# Altium project SmartWatch.PrjPcb (part 2 of 2)

## Sheet BioZ_Sensor.SchDoc
size 420 x 297 mm
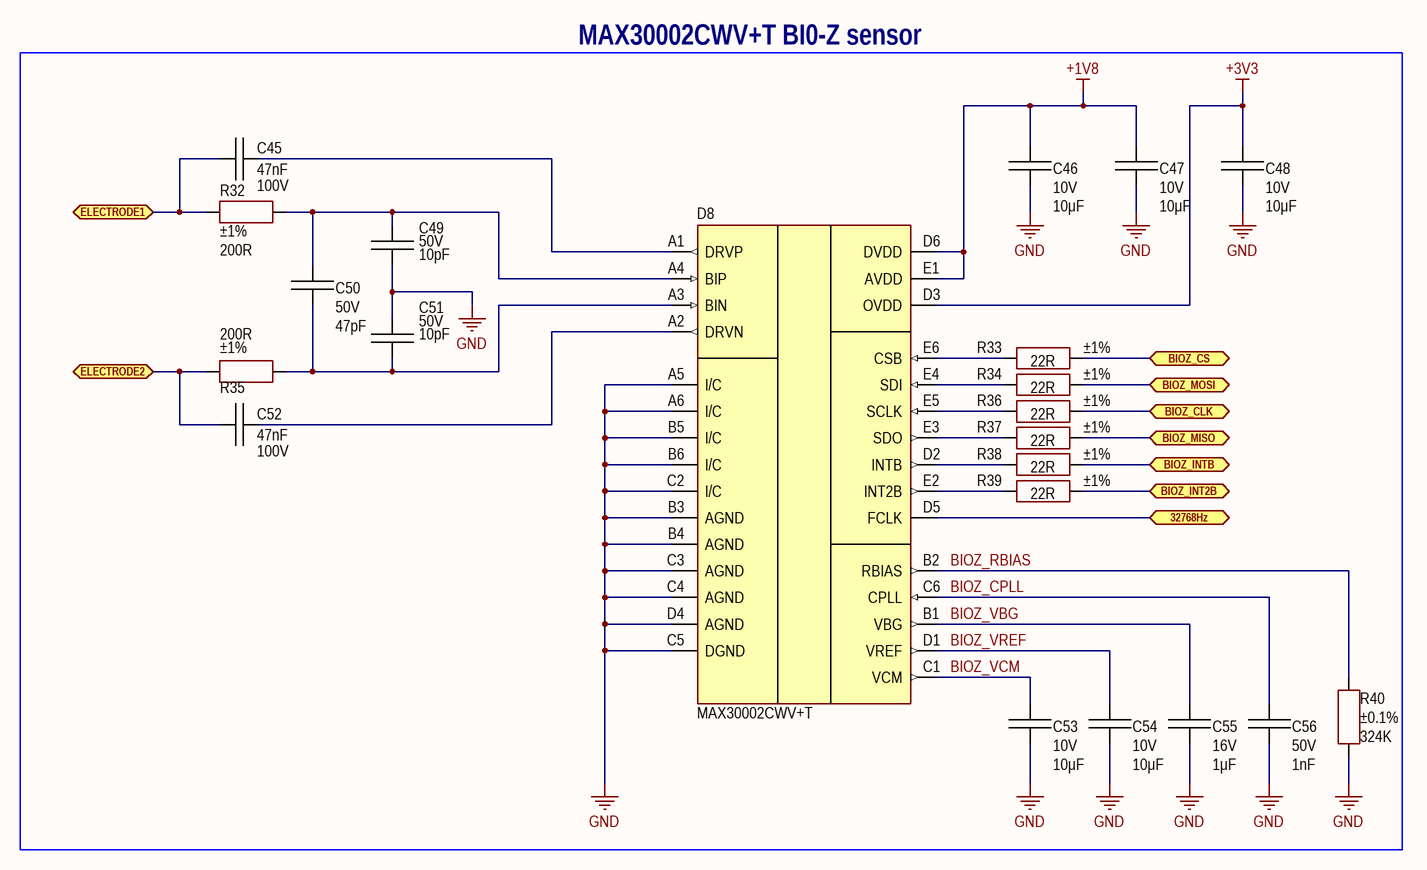
[diagram p9: BioZ_Sensor.SchDoc]

### Parts
C45  value 47nF  Voltage: 100V  [CAP: 0805]
C46  value 10μF  Voltage: 10V  [CAP: 0805]
C47  value 10μF  Voltage: 10V  [CAP: 0805]
C48  value 10μF  Voltage: 10V  [CAP: 0805]
C49  value 10pF  Voltage: 50V  [CAP: 0805]
C50  value 47pF  Voltage: 50V  [CAP: 0805]
C51  value 10pF  Voltage: 50V  [CAP: 0805]
C52  value 47nF  Voltage: 100V  [CAP: 0805]
C53  value 10μF  Voltage: 10V  [CAP: 0805]
C54  value 10μF  Voltage: 10V  [CAP: 0805]
C55  value 1μF  Voltage: 16V  [CAP: 0805]
C56  value 1nF  Voltage: 50V  [CAP: 0805]
D8  (no value)  [IC: 30-WLP]
R32  value 200R  Tolerance: ±1%  [RES: 0805]
R33  value 22R  Tolerance: ±1%  [RES: 0805]
R34  value 22R  Tolerance: ±1%  [RES: 0805]
R35  value 200R  Tolerance: ±1%  [RES: 0805]
R36  value 22R  Tolerance: ±1%  [RES: 0805]
R37  value 22R  Tolerance: ±1%  [RES: 0805]
R38  value 22R  Tolerance: ±1%  [RES: 0805]
R39  value 22R  Tolerance: ±1%  [RES: 0805]
R40  value 324K  Tolerance: ±0.1%  [RES: 0805]

### Blocks framed on the sheet
MAX30002CWV+T BI0-Z sensor: C45-C56 D8 R32-R40

### Ports
32768Hz (bidir), BIOZ_CLK (bidir), BIOZ_CS (bidir), BIOZ_INT2B (bidir), BIOZ_INTB (bidir), BIOZ_MISO (bidir), BIOZ_MOSI (bidir), ELECTRODE1 (bidir), ELECTRODE2 (bidir)

### Nets
+1V8: C46.2 C47.2 D8.D6(DVDD) D8.E1(AVDD)
+3V3: C48.2 D8.D3(OVDD)
GND: C46.1 C47.1 C48.1 C49.1 C51.2 C53.1 C54.1 C55.1 C56.1 D8.A5(I/C) D8.A6(I/C) D8.B3(AGND) D8.B4(AGND) D8.B5(I/C) D8.B6(I/C) D8.C2(I/C) D8.C3(AGND) D8.C4(AGND) D8.C5(DGND) D8.D4(AGND) R40.1
32768Hz: D8.D5(FCLK) ; port 32768Hz
BIOZ_CPLL: C56.2 D8.C6(CPLL)
BIOZ_RBIAS: D8.B2(RBIAS) R40.2
BIOZ_VBG: C55.2 D8.B1(VBG)
BIOZ_VCM: C53.2 D8.C1(VCM)
BIOZ_VREF: C54.2 D8.D1(VREF)
NetC45_1: C45.1 D8.A1(DRVP)
NetC45_2: C45.2 R32.2 ; port ELECTRODE1
NetC49_2: C49.2 C50.2 D8.A4(BIP) R32.1
NetC50_1: C50.1 C51.1 D8.A3(BIN) R35.1
NetC52_1: C52.1 D8.A2(DRVN)
NetC52_2: C52.2 R35.2 ; port ELECTRODE2
NetD7_A3: R37.2 ; port BIOZ_MISO
NetD7_B4: R36.2 ; port BIOZ_CLK
NetD7_B5: R39.2 ; port BIOZ_INT2B
NetD7_C5: R38.2 ; port BIOZ_INTB
NetD7_F10: R34.2 ; port BIOZ_MOSI
NetD7_G9: R33.2 ; port BIOZ_CS
NetD8_D2: D8.D2(INTB) R38.1
NetD8_E2: D8.E2(INT2B) R39.1
NetD8_E3: D8.E3(SDO) R37.1
NetD8_E4: D8.E4(SDI) R34.1
NetD8_E5: D8.E5(SCLK) R36.1
NetD8_E6: D8.E6(CSB) R33.1

### Notes on the sheet
- Author
- Manufacturer
- Date
- Page
- Total pages
- Size page
- A3
- Materials

### Library data of the parts
C45 C52 = Ceramic_0805: 0.047 µF ±10% 100V Ceramic Capacitor X7R 0805 (2012 Metric); Manufacturer: Yageo; PartNumber: CC0805KKX7R0BB473; ValueManufacturerPartNumber: Ceramic capacitor, 47nF, X7R, ±10%, 100V, 0805, -55...+125°C; Package: 0805; HelpURL: https://www.digikey.com/en/products/detail/yageo/CC0805KKX7R0BB473/5195282; Temperature: -55...+125°C; TypeCapacitor: Ceramic capacitor; Tolerance: ±10%; TypeDielectric: X7R
C46-C48 C53 C54 = Ceramic_0805: 10 µF ±10% 10V Ceramic Capacitor X7R 0805 (2012 Metric); Manufacturer: Yageo; PartNumber: CC0805KFX7R6BB106; ValueManufacturerPartNumber: Ceramic capacitor, 10μF, X7R, ±10%, 10V, 0805, -55...+125°C; Package: 0805; HelpURL: https://www.digikey.com/en/products/detail/yageo/CC0805KFX7R6BB106/11611326; Temperature: -55...+125°C; TypeCapacitor: Ceramic capacitor; Tolerance: ±10%; TypeDielectric: X7R
C49 C51 = Ceramic_0805: 10 pF ±1% 50V Ceramic Capacitor C0G, NP0 0805 (2012 Metric); Manufacturer: Yageo; PartNumber: CC0805FRNPO9BN100; ValueManufacturerPartNumber: Ceramic capacitor, 10pF, NP0, ±5%, 50V, 0805, -55...+125°C; Tolerance: ±5%; Package: 0805; HelpURL: https://www.digikey.com/en/products/detail/yageo/CC0805FRNPO9BN100/5883922; Temperature: -55...+125°C; TypeCapacitor: Ceramic capacitor; TypeDielectric: NP0
C50 = Ceramic_0805: 47 pF ±5% 50V Ceramic Capacitor C0G, NP0 0805 (2012 Metric); Manufacturer: Yageo; PartNumber: CC0805JRNPO9BN470; ValueManufacturerPartNumber: Ceramic capacitor, 47pF, NP0, ±10%, 50V, 0805, -55...+125°C; Tolerance: ±10%; Package: 0805; HelpURL: https://www.digikey.com/en/products/detail/yageo/CC0805JRNPO9BN470/302841; Temperature: -55...+125°C; TypeCapacitor: Ceramic capacitor; TypeDielectric: NP0
C55 = Ceramic_0805: 1 µF ±10% 16V Ceramic Capacitor X7R 0805 (2012 Metric); Manufacturer: Yageo; PartNumber: CC0805KKX7R7BB105; ValueManufacturerPartNumber: Ceramic capacitor, 1μF, X7R, ±10%, 16V, 0805, -55...+125°C; Package: 0805; HelpURL: https://www.digikey.com/en/products/detail/yageo/CC0805KKX7R7BB105/2103103; Temperature: -55...+125°C; TypeCapacitor: Ceramic capacitor; Tolerance: ±10%; TypeDielectric: X7R
C56 = Ceramic_0805: 1000 pF ±5% 50V Ceramic Capacitor C0G, NP0 0805 (2012 Metric); Manufacturer: Yageo; PartNumber: CC0805JRNPO9BN102; ValueManufacturerPartNumber: Ceramic capacitor, 1nF, NP0, ±5%, 50V, 0805, -55...+125°C; Package: 0805; HelpURL: https://www.digikey.com/en/products/detail/yageo/CC0805JRNPO9BN102/302856; Temperature: -55...+125°C; TypeCapacitor: Ceramic capacitor; Tolerance: ±5%; TypeDielectric: NP0
D8 = MAX30002CWV+T: Biopotential and Bioimpedance sensor; Manufacturer: Maxim Integrated; Supply: 1.65...3.6V; HelpURL: https://www.digikey.com/en/products/detail/maxim-integrated/MAX30002CWV-T/9833528; Package: 30-WLP; ComponentType: IC Biopotential and Bioimpedance sensor; ValueManufacturerPartNumber: =ComponentType+', '+Sensing+', '+Accuracy+', '+GainBandwidth+', '+Sensitivity+', '+Temperature+', '+Package; Temperature: 0°C..+70°C; Sensing: Biopotential and Bioimpedance sensor; PartNumber: MAX30002CWV+T
R32 R35 = Resistor_0805: 200 Ohms ±1% 0.125W, 1/8W Chip Resistor 0805 (2012 Metric) Moisture Resistant Thick Film; Manufacturer: Yageo; PartNumber: RC0805FR-07200RL; ValueManufacturerPartNumber: Resistor film, 200R, ±1%, 0805, 0.125W, -55...+125°C; TypeResistor: Resistor film; Package: 0805; HelpURL: https://www.digikey.com/en/products/detail/yageo/RC0805FR-07200RL/727723; Temperature: -55...+125°C; Power: 0.125W
R33 R34 R36-R39 = Resistor_0805: 22 Ohms ±1% 0.125W, 1/8W Chip Resistor 0805 (2012 Metric) Moisture Resistant Thick Film; Manufacturer: Yageo; PartNumber: RC0805FR-0722RL; ValueManufacturerPartNumber: Resistor film, 22R, ±1%, 0805, 0.125W, -55...+125°C; TypeResistor: Resistor film; Package: 0805; HelpURL: https://www.digikey.com/en/products/detail/yageo/RC0805FR-0722RL/727735; Temperature: -55...+125°C; Power: 0.125W
R40 = Resistor_0805: 324 kOhms ±0.1% 0.2W, 1/5W Chip Resistor 0805 (2012 Metric) Anti-Sulfur, Automotive AEC-Q200 Thin Film; Manufacturer: TE Connectivity Passive Product; PartNumber: RQ73C2A324KBTD; ValueManufacturerPartNumber: Resistor film, 324K, ±0.1%, 0805, 0.125W, -55...+125°C; TypeResistor: Resistor film; Power: 0.125W; Package: 0805; HelpURL: https://www.digikey.com/en/products/detail/te-connectivity-passive-product/RQ73C2A324KBTD/9479991; Temperature: -55...+125°C

## Sheet MCU_Power.SchDoc
size 420 x 297 mm
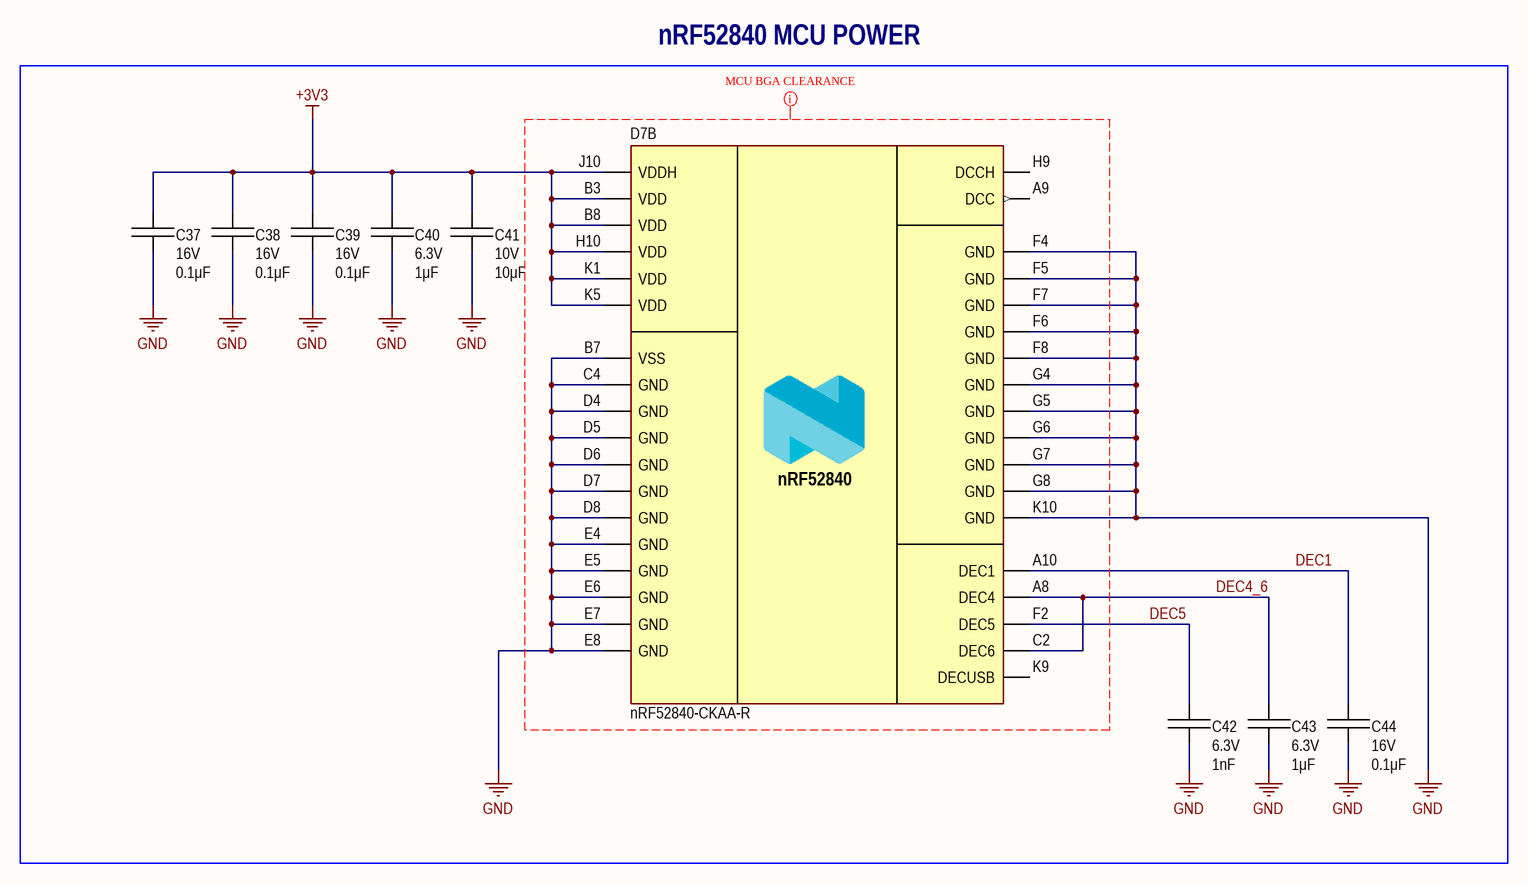
[diagram p10: MCU_Power.SchDoc]

### Parts
C37  value 0.1μF  Voltage: 16V  [CAP: 0402_NO_SILK]
C38  value 0.1μF  Voltage: 16V  [CAP: 0402_NO_SILK]
C39  value 0.1μF  Voltage: 16V  [CAP: 0402_NO_SILK]
C40  value 1μF  Voltage: 6.3V  [CAP: 0402_NO_SILK]
C41  value 10μF  Voltage: 10V  [CAP: 0805]
C42  value 1nF  Voltage: 6.3V  [CAP: 0402_NO_SILK]
C43  value 1μF  Voltage: 6.3V  [CAP: 0402_NO_SILK]
C44  value 0.1μF  Voltage: 16V  [CAP: 0402_NO_SILK]
D7  PartNumber: nRF52840-CKAA-R  [MCU: nRF52840_WLCP93]  (part B of 2)

### Blocks framed on the sheet
nRF52840 MCU POWER: C37-C44 D7

### Nets
+3V3: C37.2 C38.2 C39.2 C40.2 C41.2 D7.B3(VDD) D7.B8(VDD) D7.H10(VDD) D7.J10(VDDH) D7.K1(VDD) D7.K5(VDD)
GND: C37.1 C38.1 C39.1 C40.1 C41.1 C42.1 C43.1 C44.1 D7.B7(VSS) D7.C4(GND) D7.D4(GND) D7.D5(GND) D7.D6(GND) D7.D7(GND) D7.D8(GND) D7.E4(GND) D7.E5(GND) D7.E6(GND) D7.E7(GND) D7.E8(GND) D7.F4(GND) D7.F5(GND) D7.F6(GND) D7.F7(GND) D7.F8(GND) D7.G4(GND) D7.G5(GND) D7.G6(GND) D7.G7(GND) D7.G8(GND) D7.K10(GND)
DEC1: C44.2 D7.A10(DEC1)
DEC4_6: C43.2 D7.A8(DEC4) D7.C2(DEC6)
DEC5: C42.2 D7.F2(DEC5)

Not connected (* = marked no-connect by the designer): D7 A9(DCC) H9(DCCH) K9(DECUSB)

### Layout directives
net class MCU_BGA_CLEARANCE: (no net found under the mark)

### Notes on the sheet
- Author
- Manufacturer
- Date
- Page
- Total pages
- Size page
- A3
- Materials

### Library data of the parts
C37-C39 C44 = Ceramic_0402: 0.1 µF ±10% 16V Ceramic Capacitor X7R 0402 (1005 Metric); Manufacturer: Yageo; PartNumber: CC0402KRX7R7BB104; ValueManufacturerPartNumber: Ceramic capacitor, 0.1μF, X7R, ±10%, 16V, 0402, -55...+125°C; Package: 0402; HelpURL: https://www.digikey.com/product-detail/en/yageo/CC0402KRX7R7BB104/311-1338-1-ND/2103122; Temperature: -55...+125°C; TypeCapacitor: Ceramic capacitor; Tolerance: ±10%; TypeDielectric: X7R
C40 C43 = Ceramic_0402: 0.1 µF ±10% 16V Ceramic Capacitor X7R 0402 (1005 Metric); Manufacturer: Yageo; PartNumber: CC0402KRX7R5BB105; ValueManufacturerPartNumber: Ceramic capacitor, 1μF, X7R, ±10%, 6.3V, 0402, -55...+125°C; Package: 0402; HelpURL: https://www.digikey.com/en/products/detail/yageo/CC0402KRX7R5BB105/5195111; Temperature: -55...+125°C; TypeCapacitor: Ceramic capacitor; Tolerance: ±10%; TypeDielectric: X7R
C41 = Ceramic_0805: as C46 on sheet BioZ_Sensor; Package: 0805; HelpURL: https://www.digikey.com/en/products/detail/yageo/CC0805KFX7R6BB106/11611326; Temperature: -55...+125°C; TypeCapacitor: Ceramic capacitor; Tolerance: ±10%; TypeDielectric: X7R
C42 = Ceramic_0402: 1000 pF ±5% 25V Ceramic Capacitor C0G, NP0 0402 (1005 Metric); Manufacturer: Yageo; PartNumber: CC0402JRNPO8BN102; ValueManufacturerPartNumber: Ceramic capacitor, 1nF, X7R, ±10%, 6.3V, 0402, -55...+125°C; Tolerance: ±10%; TypeDielectric: X7R; Package: 0402; HelpURL: https://www.digikey.com/en/products/detail/yageo/CC0402JRNPO8BN102/5195068; Temperature: -55...+125°C; TypeCapacitor: Ceramic capacitor
D7 = nRF52840: MCU; Manufacturer: Nordic Semiconductor; CoreSize: 32bit; Speed: 64 MHz; MemoryROM: 1 MB; CoreProcessor: Cortex-M4; MemoryRAM: 256 kB; HelpURL: https://www.mouser.com/ProductDetail/Nordic-Semiconductor/nRF52840-CKAA-R?qs=PqoDHHvF64%2FDLCQsJ11t5w%3D%3D; ComponentType: IC microcontroller; Package: 93-WLCSP; ValueManufacturerPartNumber: =ComponentType+', '+CoreSize+', '+CoreProcessor+', '+Speed+', '+MemoryROM+', '+MemoryRAM+', '+Supply+', '+Temperature+', '+Package

## Sheet LTE+GPS_Power.SchDoc
size 420 x 297 mm
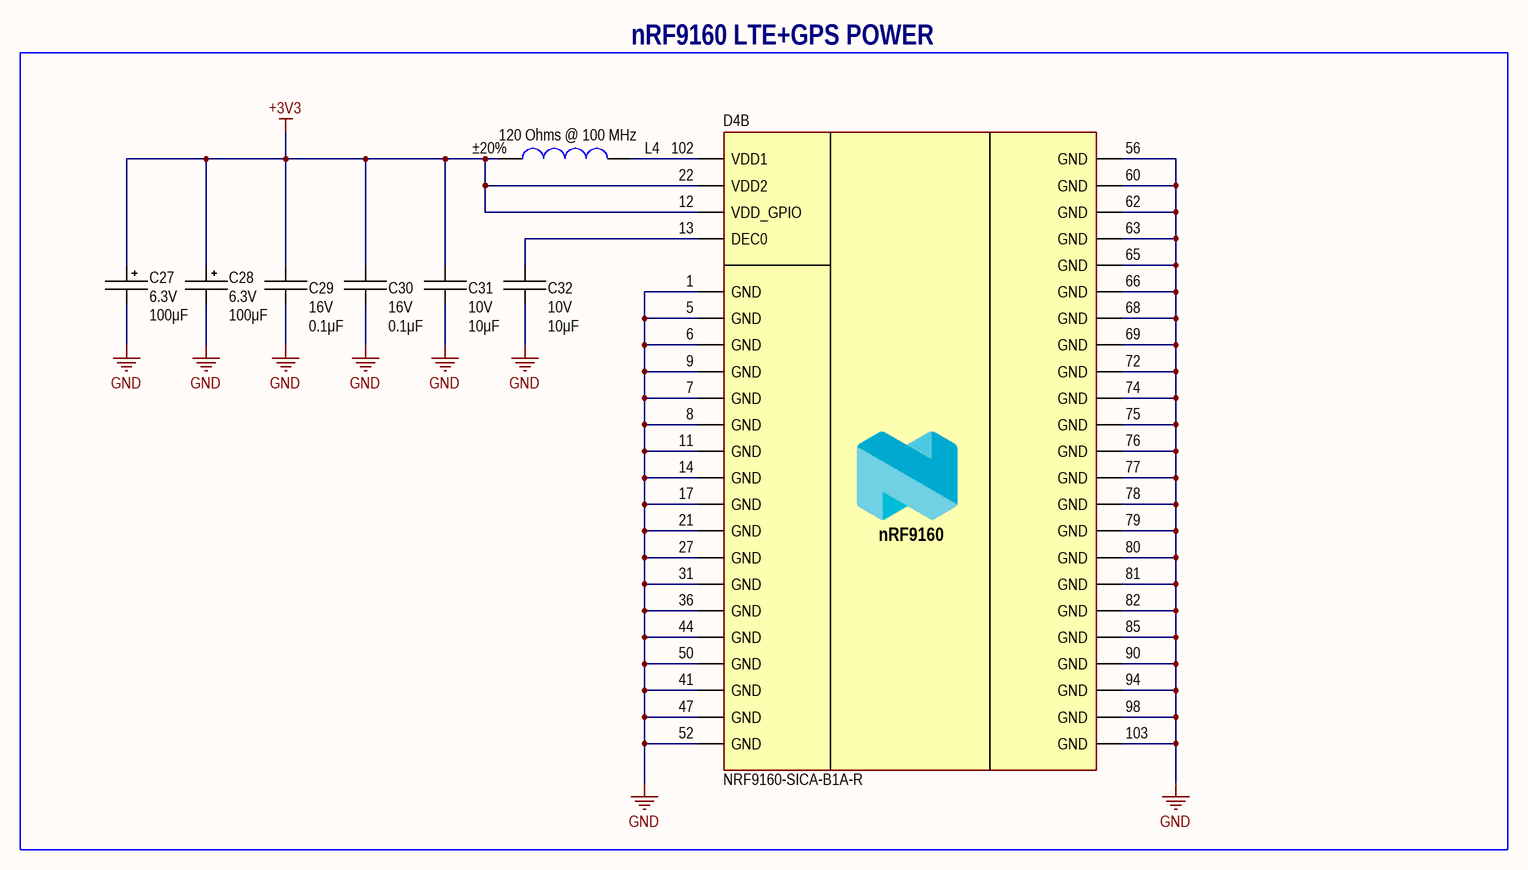
[diagram p11: LTE+GPS_Power.SchDoc]

### Parts
C27  value 100μF  Voltage: 6.3V  [CAP: TANTAL-A]
C28  value 100μF  Voltage: 6.3V  [CAP: TANTAL-A]
C29  value 0.1μF  Voltage: 16V  [CAP: 0805]
C30  value 0.1μF  Voltage: 16V  [CAP: 0805]
C31  value 10μF  Voltage: 10V  [CAP: 0805]
C32  value 10μF  Voltage: 10V  [CAP: 0805]
D4  PartNumber: NRF9160-SICA-B1A-R  [MOD: NRF9160]  (part B of 3)
L4  value 120 Ohms @ 100 MHz  Tolerance: ±20%  [IND: 0805]

### Blocks framed on the sheet
nRF9160 LTE+GPS POWER: C27-C32 D4 L4

### Nets
+3V3: C27.1 C28.1 C29.2 C30.2 C31.2 D4.12(VDD_GPIO) D4.22(VDD2) L4.2
GND: C27.2 C28.2 C29.1 C30.1 C31.1 C32.1 D4.1(GND) D4.5(GND) D4.6(GND) D4.7(GND) D4.8(GND) D4.9(GND) D4.11(GND) D4.14(GND) D4.17(GND) D4.21(GND) D4.27(GND) D4.31(GND) D4.36(GND) D4.41(GND) D4.44(GND) D4.47(GND) D4.50(GND) D4.52(GND) D4.56(GND) D4.60(GND) D4.62(GND) D4.63(GND) D4.65(GND) D4.66(GND) D4.68(GND) D4.69(GND) D4.72(GND) D4.74(GND) D4.75(GND) D4.76(GND) D4.77(GND) D4.78(GND) D4.79(GND) D4.80(GND) D4.81(GND) D4.82(GND) D4.85(GND) D4.90(GND) D4.94(GND) D4.98(GND) D4.103(GND)
NetC32_2: C32.2 D4.13(DEC0)
NetD4_102: D4.102(VDD1) L4.1

### Notes on the sheet
- Author
- Manufacturer
- Date
- Page
- Total pages
- Size page
- A3
- Materials

### Library data of the parts
C27 C28 = Tantal_A: 100 µF Molded Tantalum Polymer Capacitor 6.3 V 1206 (3216 Metric) 100mOhm @ 100kHz; Manufacturer: AVX; PartNumber: TCJA107M006R0100; ValueManufacturerPartNumber: Tantalum capacitor, 100μF, 6.3V, ±10%, 100 mOhm, case A (3216), -55...+125°C; Tolerance: ±10%; TypeDielectric: X7R; TypeCapacitor: Tantalum capacitor; Package: case A (3216); HelpURL: https://www.digikey.com/en/products/detail/avx-corporation/TCJA107M006R0100/4990371; Temperature: -55...+125°C; Impedance: 100 mOhm
C29 C30 = Ceramic_0805: Manufacturer: Yageo; PartNumber: CC0805KRX7R7BB104; ValueManufacturerPartNumber: Ceramic capacitor, 0.1μF, X7R, ±10%, 16V, 0805, -55...+125°C; TypeCapacitor: Ceramic capacitor; Tolerance: ±10%; TypeDielectric: X7R; Package: 0805; HelpURL: https://www.digikey.com/product-detail/en/yageo/CC0805KRX7R7BB104/311-1142-1-ND/303052; Temperature: -55...+125°C
C31 C32 = Ceramic_0805: as C46 on sheet BioZ_Sensor; Package: 0805; HelpURL: https://www.digikey.com/en/products/detail/yageo/CC0805KFX7R6BB106/11611326; Temperature: -55...+125°C; TypeCapacitor: Ceramic capacitor; Tolerance: ±10%; TypeDielectric: X7R
D4 = nRF9160: LTE/GSM module; Manufacturer: Nordic Semiconductor; Supply: 3...5.5V; Frequency: 2.4GHz; TypeProtocol: LTE-M/NB-IoT/GPS; HelpURL: https://www.digikey.com/en/products/detail/nordic-semiconductor-asa/NRF9160-SICA-B1A-R/13533595; Package: 127-LGA; ComponentType: LTE/GSM module; ValueManufacturerPartNumber: =ComponentType+', '+TypeProtocol+', '+Frequency+', '+CoreSize+', '+CoreProcessor+', '+MemoryROM+', '+MemoryRAM+', '+Supply+', '+Temperature+', '+Package; Temperature: -40...+85°C
L4 = Inductor_0805: 120 Ohms @ 100 MHz 1 Power Line Ferrite Bead 0805 (2012 Metric) 3A 30mOhm; Manufacturer: Murata Electronics; PartNumber: BLM21PG121SH1D; ValueManufacturerPartNumber: Fixed inductor, 120 Ohms @ 100 MHz, ±20%, 0805, 3A, -55...+125°C; TypeInductor: Fixed inductor; Package: 0805; HelpURL: https://www.digikey.com/en/products/detail/murata-electronics/BLM21PG121SH1D/4419690; Temperature: -55...+125°C; MaxCurrent: 3A

## Nets that join several sheets
+1V8: Charger+Main_Power (C8.2 D3.3), BioZ_Sensor (C46.2 C47.2 D8.D6 D8.E1)
+3V3: MCU (C34.2 Z2.1 Z2.4), Accelerometer (C1.2 C2.2 D1.3 D1.7), Charger+Main_Power (C9.2 D3.2), Connectors (R13.1), LTE+GPS (C12.1 L1.1 L2.1), Flash (C57.2 D9.8), TempSensor (C62.2 D11.5 R52.1 R53.1), SpO_Sensor (6 pins), BioZ_Sensor (C48.2 D8.D3), MCU_Power (11 pins), LTE+GPS_Power (8 pins)
+VBAT: Charger+Main_Power (8 pins), Connectors (FU2.2 VD7.2)
+VBUS: Charger+Main_Power (C3.2 D2.A2), Connectors (5 pins)
GND: MCU (11 pins), Accelerometer (6 pins), Charger+Main_Power (14 pins), Connectors (14 pins), LTE+GPS (23 pins), Flash (C57.1 D9.0 D9.4), TempSensor (C62.1 D11.2), SpO_Sensor (8 pins), BioZ_Sensor (21 pins), MCU_Power (31 pins), LTE+GPS_Power (47 pins)
32768Hz: MCU (D7.B9 R31.1 TP30.1), BioZ_Sensor (D8.D5)
BAT_TS: Charger+Main_Power (C4.2 D2.B1), Connectors (VD8.2 X4.2)
NetC6_2: MCU (D7.B6 TP28.1), Charger+Main_Power (C6.2 R9.2 R12.1)
NetC11_2: MCU (D7.K6), Connectors (C11.2 R13.2 R15.2 VD5.2)
NetC45_2: Connectors (X5.1), BioZ_Sensor (C45.2 R32.2)
NetC52_2: Connectors (X5.2), BioZ_Sensor (C52.2 R35.2)
NetD4_32: Connectors (X1.3), LTE+GPS (D4.32)
NetD4_33: Connectors (X1.4), LTE+GPS (D4.33)
NetD4_34: Connectors (X1.2), LTE+GPS (D4.34)
NetD7_A3: MCU (D7.A3 TP20.1), BioZ_Sensor (R37.2)
NetD7_B4: MCU (D7.B4 TP18.1), BioZ_Sensor (R36.2)
NetD7_B5: MCU (D7.B5 TP24.1), BioZ_Sensor (R39.2)
NetD7_C5: MCU (D7.C5 TP22.1), BioZ_Sensor (R38.2)
NetD7_C10: MCU (D7.C10), LTE+GPS (R23.1)
NetD7_D10: MCU (D7.D10), LTE+GPS (R24.1)
NetD7_E3: MCU (D7.E3 TP11.1), TempSensor (D11.6 R52.2)
NetD7_E9: MCU (D7.E9 TP4.1), Flash (R41.1)
NetD7_E10: MCU (D7.E10 TP8.1), Flash (R43.1)
NetD7_F3: MCU (D7.F3 TP5.1), Accelerometer (R4.1)
NetD7_F9: MCU (D7.F9 TP6.1), Flash (R42.1)
NetD7_F10: MCU (D7.F10 TP16.1), BioZ_Sensor (R34.2)
NetD7_G1: MCU (D7.G1 TP13.1), TempSensor (D11.1 R53.2)
NetD7_G2: MCU (D7.G2 TP9.1), Accelerometer (R6.1 R7.2)
NetD7_G3: MCU (D7.G3 TP3.1), Accelerometer (R3.1)
NetD7_G9: MCU (D7.G9 TP15.1), BioZ_Sensor (R33.2)
NetD7_G10: MCU (D7.G10 TP12.1), Flash (R45.1)
NetD7_H1: MCU (D7.H1 TP7.1), Accelerometer (R5.1 R8.2)
NetD7_H2: MCU (D7.H2), Connectors (R16.2 VD4.2)
NetD7_H6: MCU (D7.H6 TP19.1), LTE+GPS (R28.1)
NetD7_H7: MCU (D7.H7 TP14.1), Flash (R46.1)
NetD7_H8: MCU (D7.H8 TP10.1), Flash (R44.1)
NetD7_J1: MCU (D7.J1 TP2.1), Accelerometer (R2.1)
NetD7_J2: MCU (D7.J2), Connectors (R14.2 VD6.2)
NetD7_J3: MCU (D7.J3 TP1.1), Accelerometer (R1.1)
NetD7_J4: MCU (D7.J4 TP26.1), SpO_Sensor (D10.2 R48.2)
NetD7_J5: MCU (D7.J5 TP25.1), SpO_Sensor (D10.1 R47.2)
NetD7_J6: MCU (D7.J6 TP21.1), LTE+GPS (R18.1)
NetD7_K2: MCU (D7.K2 TP29.1), SpO_Sensor (D10.14 R49.2)
NetD7_K3: MCU (D7.K3 TP27.1), SpO_Sensor (R50.1)
NetD7_K4: MCU (D7.K4 TP23.1), LTE+GPS (R19.1)
NetD7_K7: MCU (D7.K7 TP17.1), LTE+GPS (R21.1)